# EasyEDA schematic SCH.json
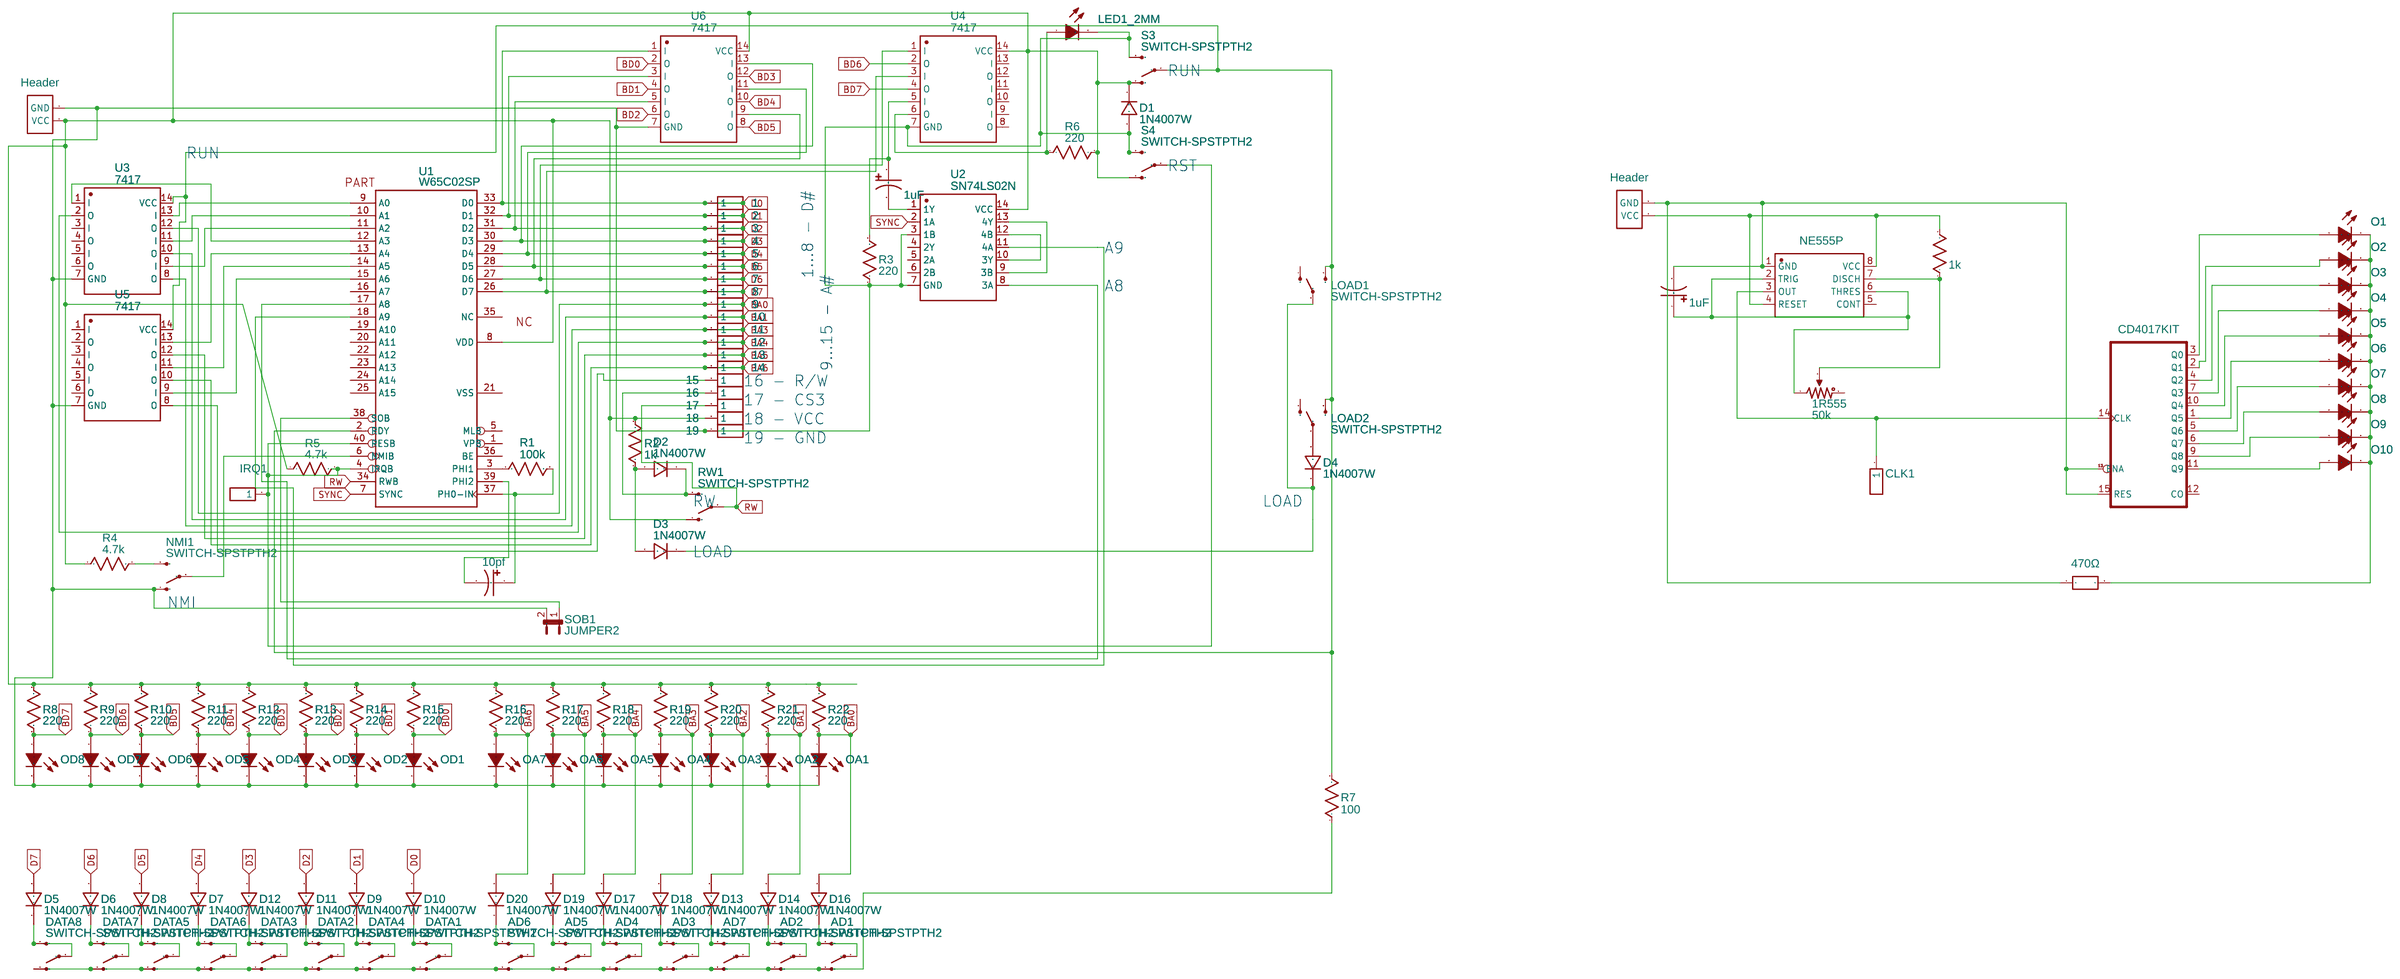
[diagram p0: schematic sheet]

## Parts
1  C81276  [HDR-TH_1P-P2.54-V-M]
1R555  50k  [RES-ADJ_3296X]
2  C81276  [HDR-TH_1P-P2.54-V-M]
2R555  1k  [AXIAL-0.3]
3  C81276  [HDR-TH_1P-P2.54-V-M]
4  C81276  [HDR-TH_1P-P2.54-V-M]
5  C81276  [HDR-TH_1P-P2.54-V-M]
6  C81276  [HDR-TH_1P-P2.54-V-M]
7  C81276  [HDR-TH_1P-P2.54-V-M]
8  C81276  [HDR-TH_1P-P2.54-V-M]
9  C81276  [HDR-TH_1P-P2.54-V-M]
10  C81276  [HDR-TH_1P-P2.54-V-M]
11  C81276  [HDR-TH_1P-P2.54-V-M]
12  C81276  [HDR-TH_1P-P2.54-V-M]
13  C81276  [HDR-TH_1P-P2.54-V-M]
14  C81276  [HDR-TH_1P-P2.54-V-M]
15  C81276  [HDR-TH_1P-P2.54-V-M]
16  C81276  [HDR-TH_1P-P2.54-V-M]
17  C81276  [HDR-TH_1P-P2.54-V-M]
18  C81276  [HDR-TH_1P-P2.54-V-M]
19  C81276  [HDR-TH_1P-P2.54-V-M]
300HEADER  Header  [HEADER-FEMALE-2.54_1X2]
555  NE555P  [DIP-8_L9.8-W6.6-P2.54-LS7.6-BL]
555HEADER  Header  [HEADER-FEMALE-2.54_1X2]
555U5  CD4017KIT  [DIL16-KIT]
AD1  SWITCH-SPSTPTH2  [SWITCHE-DPDT]
AD2  SWITCH-SPSTPTH2  [SWITCHE-DPDT]
AD3  SWITCH-SPSTPTH2  [SWITCHE-DPDT]
AD4  SWITCH-SPSTPTH2  [SWITCHE-DPDT]
AD5  SWITCH-SPSTPTH2  [SWITCHE-DPDT]
AD6  SWITCH-SPSTPTH2  [SWITCHE-DPDT]
AD7  SWITCH-SPSTPTH2  [SWITCHE-DPDT]
C1  1uF  [CAP-TH_BD5.0-P2.00-D0.8-FD]
C2  10pf  [CAP-TH_BD5.0-P2.00-D0.8-FD]
CAP555  1uF  [CAP-TH_BD5.0-P2.00-D0.8-FD]
CLK1  C81276  [HDR-TH_1P-P2.54-V-M]
D1  1N4007W  [SOD-123_L2.8-W1.8-LS3.7-RD]
D2  1N4007W  [SOD-123_L2.8-W1.8-LS3.7-RD]
D3  1N4007W  [SOD-123_L2.8-W1.8-LS3.7-RD]
D4  1N4007W  [SOD-123_L2.8-W1.8-LS3.7-RD]
D5  1N4007W  [SOD-123_L2.8-W1.8-LS3.7-RD]
D6  1N4007W  [SOD-123_L2.8-W1.8-LS3.7-RD]
D7  1N4007W  [SOD-123_L2.8-W1.8-LS3.7-RD]
D8  1N4007W  [SOD-123_L2.8-W1.8-LS3.7-RD]
D9  1N4007W  [SOD-123_L2.8-W1.8-LS3.7-RD]
D10  1N4007W  [SOD-123_L2.8-W1.8-LS3.7-RD]
D11  1N4007W  [SOD-123_L2.8-W1.8-LS3.7-RD]
D12  1N4007W  [SOD-123_L2.8-W1.8-LS3.7-RD]
D13  1N4007W  [SOD-123_L2.8-W1.8-LS3.7-RD]
D14  1N4007W  [SOD-123_L2.8-W1.8-LS3.7-RD]
D16  1N4007W  [SOD-123_L2.8-W1.8-LS3.7-RD]
D17  1N4007W  [SOD-123_L2.8-W1.8-LS3.7-RD]
D18  1N4007W  [SOD-123_L2.8-W1.8-LS3.7-RD]
D19  1N4007W  [SOD-123_L2.8-W1.8-LS3.7-RD]
D20  1N4007W  [SOD-123_L2.8-W1.8-LS3.7-RD]
DATA1  SWITCH-SPSTPTH2  [SWITCHE-DPDT]
DATA2  SWITCH-SPSTPTH2  [SWITCHE-DPDT]
DATA3  SWITCH-SPSTPTH2  [SWITCHE-DPDT]
DATA4  SWITCH-SPSTPTH2  [SWITCHE-DPDT]
DATA5  SWITCH-SPSTPTH2  [SWITCHE-DPDT]
DATA6  SWITCH-SPSTPTH2  [SWITCHE-DPDT]
DATA7  SWITCH-SPSTPTH2  [SWITCHE-DPDT]
DATA8  SWITCH-SPSTPTH2  [SWITCHE-DPDT]
IRQ1  C81276  [HDR-TH_1P-P2.54-V-M]
LED1_2MM  LED_5MM  [LED-TH_BD5.0-P2.54-FD_C9900023552]
LOAD1  SWITCH-SPSTPTH2  [SWITCHE-DPDT]
LOAD2  SWITCH-SPSTPTH2  [SWITCHE-DPDT]
NMI1  SWITCH-SPSTPTH2  [SWITCHE-DPDT]
O1  LED_5MM  [LED-TH_BD5.0-P2.54-FD_C9900023552]
O2  LED_5MM  [LED-TH_BD5.0-P2.54-FD_C9900023552]
O3  LED_5MM  [LED-TH_BD5.0-P2.54-FD_C9900023552]
O4  LED_5MM  [LED-TH_BD5.0-P2.54-FD_C9900023552]
O5  LED_5MM  [LED-TH_BD5.0-P2.54-FD_C9900023552]
O6  LED_5MM  [LED-TH_BD5.0-P2.54-FD_C9900023552]
O7  LED_5MM  [LED-TH_BD5.0-P2.54-FD_C9900023552]
O8  LED_5MM  [LED-TH_BD5.0-P2.54-FD_C9900023552]
O9  LED_5MM  [LED-TH_BD5.0-P2.54-FD_C9900023552]
O10  LED_5MM  [LED-TH_BD5.0-P2.54-FD_C9900023552]
OA1  LED_5MM  [LED-TH_BD5.0-P2.54-FD_C9900023552]
OA2  LED_5MM  [LED-TH_BD5.0-P2.54-FD_C9900023552]
OA3  LED_5MM  [LED-TH_BD5.0-P2.54-FD_C9900023552]
OA4  LED_5MM  [LED-TH_BD5.0-P2.54-FD_C9900023552]
OA5  LED_5MM  [LED-TH_BD5.0-P2.54-FD_C9900023552]
OA6  LED_5MM  [LED-TH_BD5.0-P2.54-FD_C9900023552]
OA7  LED_5MM  [LED-TH_BD5.0-P2.54-FD_C9900023552]
OD1  LED_5MM  [LED-TH_BD5.0-P2.54-FD_C9900023552]
OD2  LED_5MM  [LED-TH_BD5.0-P2.54-FD_C9900023552]
OD3  LED_5MM  [LED-TH_BD5.0-P2.54-FD_C9900023552]
OD4  LED_5MM  [LED-TH_BD5.0-P2.54-FD_C9900023552]
OD5  LED_5MM  [LED-TH_BD5.0-P2.54-FD_C9900023552]
OD6  LED_5MM  [LED-TH_BD5.0-P2.54-FD_C9900023552]
OD7  LED_5MM  [LED-TH_BD5.0-P2.54-FD_C9900023552]
OD8  LED_5MM  [LED-TH_BD5.0-P2.54-FD_C9900023552]
R1  100k  [R0603]
R2  1k  [R0603]
R3  220  [R0603]
R4  4.7k  [R0603]
R5  4.7k  [R0603]
R6  220  [R0603]
R7  100  [R0603]
R8  220  [R0603]
R9  220  [R0603]
R10  220  [R0603]
R11  220  [R0603]
R12  220  [R0603]
R13  220  [R0603]
R14  220  [R0603]
R15  220  [R0603]
R16  220  [R0603]
R17  220  [R0603]
R18  220  [R0603]
R19  220  [R0603]
R20  220  [R0603]
R21  220  [R0603]
R22  220  [R0603]
RW1  SWITCH-SPSTPTH2  [SWITCHE-DPDT]
S3  SWITCH-SPSTPTH2  [SWITCHE-DPDT]
S4  SWITCH-SPSTPTH2  [SWITCHE-DPDT]
SOB1  JUMPER2  [JUMPER2]
U1  W65C02SP  [DIP-40]
U2  SN74LS02N  [DIP14]
U3  7417  [DIP14]
U4  7417  [DIP14]
U5  7417  [DIP14]
U6  7417  [DIP14]
U555  470Ω  [RES-TH_BD3.3-L9.0-P13.00-D0.6]

## Library data of the parts
1-19 CLK1 IRQ1 = Header-Male-2.54_1x1: Supplier: LCSC; Manufacturer Part: 2.54-1*1P针; JLCPCB Part Class: Extended Part; Package Display: No; Manufacturer: BOOMELE(Boom Precision Elec); Contributor: Thejo Prakash
1R555 = Potentiometer: K(%): 50; Manufacturer Part: ?; Supplier: LCSC
2R555 = Resistor: Manufacturer Part: ?; Supplier: LCSC
300HEADER = HEADER-FEMALE-2.54_1X2: Contributor: nonstop2004; Supplier: LCSC; Supplier Part: C492401
555 = NE555P: Supplier: LCSC; Manufacturer: TI(德州仪器); Supplier Part: C46749; JLCPCB Part Class: Extended Part
555HEADER = HEADER-FEMALE-2.54_1X2: Contributor: nonstop2004; Supplier: LCSC
555U5 = CD4017KIT: Contributor: SparkFun; subpart_no: 1; Supplier: LCSC
AD1-AD7 DATA1-DATA8 LOAD1 LOAD2 NMI1 RW1 S3 S4 = SWITCH-SPSTPTH2: SPST Switch; Contributor: Pinoccio
C1 C2 = UVZ1H010MDD: Contributor: LCSC; Supplier: LCSC; Supplier Part: C62934; Manufacturer: Nichicon(尼吉康)
CAP555 = UVZ1H010MDD: Contributor: LCSC; Supplier: LCSC; Supplier Part: C433277; Manufacturer: Nichicon(尼吉康)
D1-D14 D16-D20 = 1N4007W: Supplier: LCSC; Supplier Part: C328592; Manufacturer: BLUE ROCKET; Contributor: LCEDA_Lib
LED1_2MM OA1-OA7 OD1-OD8 = LED_5MM: Contributor: lcsc; Supplier: LCSC; Supplier Part: C2992663
O1-O10 = LED_5MM: Contributor: lcsc; Supplier: LCSC; Supplier Part: C2936518; Manufacturer: null; JLCPCB Part Class: Extended Part
R1-R22 = R_0603_US: Contributor: LCEDA_Lib
SOB1 = JUMPER2: Jumper 2 Pin; Contributor: PatternAgents
U1 = W65C02SP
U2 = SN74LS02N
U3-U6 = 7417
U555 = RSF-50JT-52-470R: Contributor: lcsc; Supplier: LCSC; Supplier Part: C1377653; Manufacturer: YAGEO(国巨)

## Nets
BA0: 9.1 D16.2 OA1.1(A) R22.1 U3.12(O)
BA1: 10.1 D14.2 OA2.1(A) R21.1 U3.10(O)
BA2: D13.2 OA3.1(A) R20.1
BA3: 11.1 D18.2 OA4.1(A) R19.1 U3.8(O)
BA4: 12.1 D17.2 OA5.1(A) R18.1 U3.2(O)
BA5: 13.1 D19.2 OA6.1(A) R17.1 U5.12(O)
BA6: 14.1 D20.2 OA7.1(A) R16.1 U5.10(O)
BD0: OD1.1(A) R15.1 U6.2(O)
BD1: OD2.1(A) R14.1 U6.4(O)
BD2: OD3.1(A) R13.1 U6.6(O)
BD3: OD4.1(A) R12.1 U6.12(O)
BD4: OD5.1(A) R11.1 U6.10(O)
BD5: OD6.1(A) R10.1 U6.8(O)
BD6: OD7.1(A) R9.1 U4.2(O)
BD7: OD8.1(A) R8.1 U4.4(O)
D0: 1.1 D10.2 U1.33(D0) U6.1(I)
D1: 2.1 D9.2 U1.32(D1) U6.3(I)
D2: 3.1 D11.2 U1.31(D2) U6.5(I)
D3: 4.1 D12.2 U1.30(D3) U6.13(I)
D4: 5.1 D7.2 U1.29(D4) U6.11(I)
D5: 6.1 D8.2 U1.28(D5) U6.9(I)
D6: 7.1 D6.2 U1.27(D6) U4.1(I)
D7: 8.1 D5.2 U1.26(D7) U4.3(I)
RW: 17.1 RW1.2(P) U1.34(RWB)
SYNC: U1.7(SYNC) U2.2(1A)
Net-(1R555-1): 1R555.1 555.2(TRIG) 555.6(THRES) CAP555.1
Net-(1R555-2): 1R555.2(3) 2R555.1 555.7(DISCH)
Net-(2R555-2): 2R555.2 555.4(RESET) 555.8(VCC) 555HEADER.1(VCC)
Net-(15-1): 15.1 U5.8(O)
Net-(16-1): 16.1 D2.1 RW1.3(S)
Net-(18-1): 18.1 300HEADER.1(VCC) D1.1 R2.2 R4.1 R5.1 R6.2 R8.2 R9.2 R10.2 R11.2 R12.2 R13.2 R14.2 R15.2 R16.2 R17.2 R18.2 R19.2 R20.2 R21.2 R22.2 RW1.1(O) S3.1(O) S4.1(O) U1.8(VDD) U2.14(VCC) U4.14(VCC) U6.14(VCC)
Net-(19-1): 19.1 300HEADER.2(GND) D1.2 LED1_2MM.2(K) NMI1.1(O) OA1.2(K) OA2.2(K) OA3.2(K) OA4.2(K) OA5.2(K) OA6.2(K) OA7.2(K) OD1.2(K) OD2.2(K) OD3.2(K) OD4.2(K) OD5.2(K) OD6.2(K) OD7.2(K) OD8.2(K) R3.1 S3.3(S) S4.3(S) SOB1.2 U2.3(1B) U2.7(GND) U3.7(GND) U4.7(GND) U5.7(GND) U6.7(GND)
Net-(555-1): 555.1(GND) 555HEADER.2(GND) 555U5.13(ENA) 555U5.15(RES) CAP555.2 U555.1
Net-(555-3): 555.3(OUT) 555U5.14(CLK) CLK1.1
Net-(555U5-1): 555U5.1(Q5) O6.1(A)
Net-(555U5-2): 555U5.2(Q1) O2.1(A)
Net-(555U5-3): 555U5.3(Q0) O1.1(A)
Net-(555U5-4): 555U5.4(Q2) O3.1(A)
Net-(555U5-5): 555U5.5(Q6) O7.1(A)
Net-(555U5-6): 555U5.6(Q7) O8.1(A)
Net-(555U5-7): 555U5.7(Q3) O4.1(A)
Net-(555U5-9): 555U5.9(Q8) O9.1(A)
Net-(555U5-10): 555U5.10(Q4) O5.1(A)
Net-(555U5-11): 555U5.11(Q9) O10.1(A)
Net-(AD1-1): AD1.1(O) AD2.1(O) AD3.1(O) AD4.1(O) AD5.1(O) AD6.1(O) AD7.1(O) DATA1.1(O) DATA2.1(O) DATA3.1(O) DATA4.1(O) DATA5.1(O) DATA6.1(O) DATA7.1(O) DATA8.1(O) R7.1
Net-(AD1-2): AD1.2(P) AD1.3(S) D16.1
Net-(AD2-2): AD2.2(P) AD2.3(S) D14.1
Net-(AD3-2): AD3.2(P) AD3.3(S) D18.1
Net-(AD4-2): AD4.2(P) AD4.3(S) D17.1
Net-(AD5-2): AD5.2(P) AD5.3(S) D19.1
Net-(AD6-2): AD6.2(P) AD6.3(S) D20.1
Net-(AD7-2): AD7.2(P) AD7.3(S) D13.1
Net-(C1-1): C1.1 R3.2 U4.5(I)
Net-(C1-2): C1.2 U2.1(1Y)
Net-(C2-1): C2.1 R1.2 U1.37(PH0-IN)
Net-(C2-2): C2.2 U1.39(PHI2)
Net-(D2-2): D2.2 D3.2 R2.1
Net-(D3-1): D3.1 D4.1 LOAD1.2(P)
Net-(D4-2): D4.2 LOAD2.2(P)
Net-(D5-1): D5.1 DATA8.2(P) DATA8.3(S)
Net-(D6-1): D6.1 DATA7.2(P) DATA7.3(S)
Net-(D7-1): D7.1 DATA6.2(P) DATA6.3(S)
Net-(D8-1): D8.1 DATA5.2(P) DATA5.3(S)
Net-(D9-1): D9.1 DATA4.2(P) DATA4.3(S)
Net-(D10-1): D10.1 DATA1.2(P) DATA1.3(S)
Net-(D11-1): D11.1 DATA2.2(P) DATA2.3(S)
Net-(D12-1): D12.1 DATA3.2(P) DATA3.3(S)
Net-(IRQ1-1): IRQ1.1 R5.2 S4.2(P) U1.4(IRQB) U1.40(RESB)
Net-(LED1_2MM-1): LED1_2MM.1(A) R6.1 U4.6(O)
Net-(LOAD1-3): LOAD1.3(S) LOAD2.3(S) R7.2 S3.2(P) U1.2(RDY) U3.14(VCC) U5.14(VCC)
Net-(NMI1-2): NMI1.2(P) U1.6(NMIB)
Net-(NMI1-3): NMI1.3(S) R4.2
Net-(O1-2): O1.2(K) O2.2(K) O3.2(K) O4.2(K) O5.2(K) O6.2(K) O7.2(K) O8.2(K) O9.2(K) O10.2(K) U555.2
Net-(R1-1): R1.1 U1.3(PHI1)
Net-(SOB1-1): SOB1.1 U1.38(SOB)
Net-(U1-9): U1.9(A0) U3.13(I)
Net-(U1-10): U1.10(A1) U3.11(I)
Net-(U1-11): U1.11(A2) U3.9(I)
Net-(U1-12): U1.12(A3) U3.1(I)
Net-(U1-13): U1.13(A4) U5.13(I)
Net-(U1-14): U1.14(A5) U5.11(I)
Net-(U1-15): U1.15(A6) U5.9(I)
Net-(U1-17): U1.17(A8) U2.8(3A)
Net-(U1-18): U1.18(A9) U2.11(4A)
Net-(U2-9): U2.9(3B) U2.13(4Y)
Net-(U2-10): U2.10(3Y) U2.12(4B)

Not connected (* = marked no-connect by the designer): 1R555 3(2); 555 5(CONT); 555U5 12(CO); LOAD1 1(O); LOAD2 1(O); U1 1(VPB) 5(MLB) 16(A7) 19(A10) 20(A11) 21(VSS) 22(A12) 23(A13) 24(A14) 25(A15) 35(NC) 36(BE); U2 4(2Y) 5(2A) 6(2B); U3 3(I) 4(O) 5(I) 6(O); U4 8(O) 9(I) 10(O) 11(I) 12(O) 13(I); U5 1(I) 2(O) 3(I) 4(O) 5(I) 6(O)

## Notes on the sheet
- RUN
- RUN
- RST
- A9
- 1...8 - D#
- A8
- 9...15 - A#
- 16 - R/W
- 17 - CS3
- 18 - VCC
- 19 - GND
- RW
- LOAD
- LOAD
- NMI
